# Altium schematic sheet 2_USB_UART.SchDoc
size A4; SheetNumber: 3; SheetTotal: 4
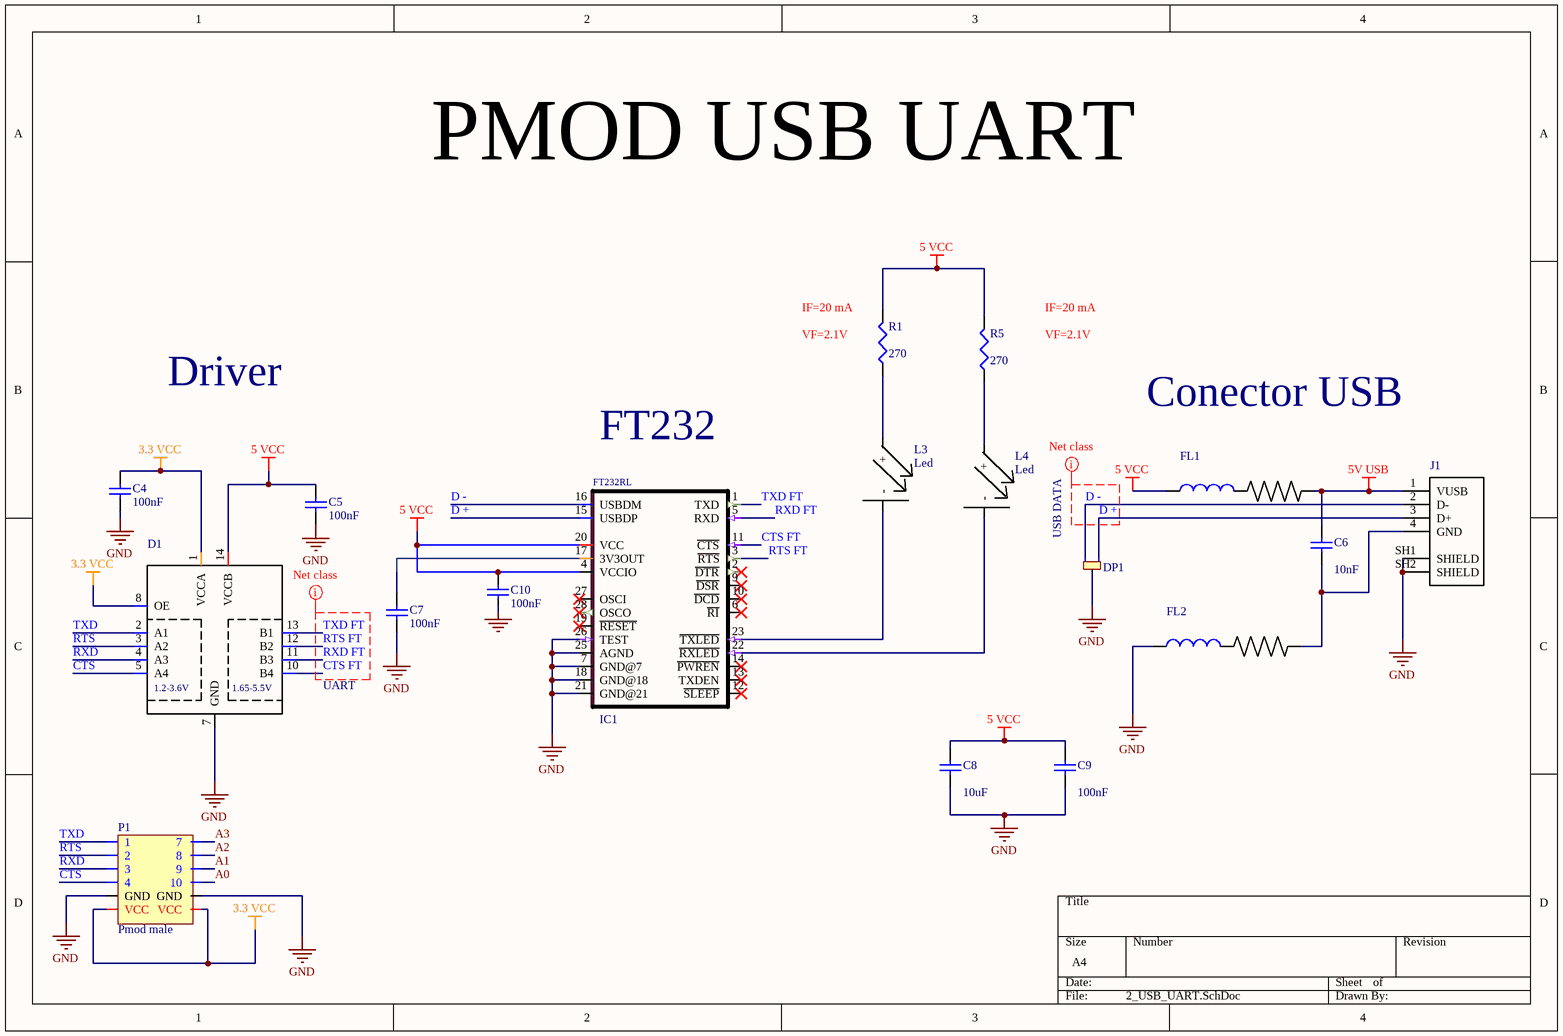
[diagram p0: 2_USB_UART.SchDoc]

## Parts
C4  value 100nF  [1608[0603]]  (hidden comment: Cap Semi)
C5  value 100nF  [1608[0603]]  (hidden comment: Cap Semi)
C6  value 10nF  [1608[0603]]  (hidden comment: Cap Semi)
C7  value 100nF  [1608[0603]]  (hidden comment: Cap Semi)
C8  value 10uF  [1608[0603]]  (hidden comment: Cap Semi)
C9  value 100nF  [1608[0603]]  (hidden comment: Cap Semi)
C10  value 100nF  [1608[0603]]  (hidden comment: Cap Semi)
D1  TXB0104PWR  [*TSSOP14]  (value not drawn)
DP1  PESD5V0U2BT,215  [*SOT95P230X110-3N]  (value not drawn)
FL1  BLM21PG221SN1D  [*BEADC2012X105N]  (value not drawn)
FL2  BLM21PG221SN1D  [*BEADC2012X105N]  (value not drawn)
IC1  FT232RL  [*SSOP28-LD]  (value not drawn)
J1  1-1734346-1  [*TE_1-1734346-1_1-1734346-1(Primary)]  (value not drawn)
L3  Led  [Diode1206 - PIN LETTER]
L4  Led  [Diode1206 - PIN LETTER]
P1  Pmod male  [901220766]
R1  value 270  [J1-0603]  (hidden comment: 270R)
R5  value 270  [J1-0603]  (hidden comment: 270R)

## Nets
3.3 VCC: C4.1 D1.1(VCCA) D1.8(OE) P1.6(VCC) P1.12(VCC)
5 VCC: C5.1 C8.2 C9.2 C10.1 D1.14(VCCB) FL1.1 IC1.4(VCCIO) IC1.20(VCC) R1.2 R5.2
5V USB: C6.2 FL1.2 J1.1(VUSB)
GND: C4.2 C5.2 C7.2 C8.1 C9.1 C10.2 D1.7(GND) DP1.3 FL2.1 IC1.7(GND@7) IC1.18(GND@18) IC1.21(GND@21) IC1.25(AGND) IC1.26(TEST) J1.SH1(SHIELD) J1.SH2(SHIELD) P1.5(GND) P1.11(GND)
A0: P1.10
A1: P1.9
A2: P1.8
A3: P1.7
CTS: D1.5(A4) P1.4
CTS FT: D1.10(B4) IC1.11(~{CTS})
D +: DP1.1 IC1.15(USBDP) J1.3(D+)
D -: DP1.2 IC1.16(USBDM) J1.2(D-)
RTS: D1.3(A2) P1.2
RTS FT: D1.12(B2) IC1.3(~{RTS})
RXD: D1.4(A3) P1.3
RXD FT: D1.11(B3) IC1.5(RXD)
TXD: D1.2(A1) P1.1
TXD FT: D1.13(B1) IC1.1(TXD)
NetC6_1: C6.1 FL2.2 J1.4(GND)
NetC7_1: C7.1 IC1.17(3V3OUT)
NetIC1_22: IC1.22(~{RXLED}) L4.K(-)
NetIC1_23: IC1.23(~{TXLED}) L3.K(-)
NetL3_A: L3.A(+) R1.1
NetL4_A: L4.A(+) R5.1

Not connected (* = marked no-connect by the designer): IC1 2(~{DTR})* 6(~{RI})* 9(~{DSR})* 10(~{DCD})* 12(~{SLEEP})* 13(TXDEN)* 14(~{PWREN})* 19(~{RESET})* 27(OSCI)* 28(OSCO)*

## Layout directives
net class USB DATA: D +, D -
net class UART: CTS FT, RTS FT, RXD FT, TXD FT

## Notes on the sheet
- PMOD USB UART
- (near R1) IF=20 mA
- IF=20 mA
- (near R1) VF=2.1V
- VF=2.1V
- Driver
- FT232
- Conector USB
- (in symbol TXB0104PWR) 1.2-3.6V; 1.65-5.5V

## Library data of the parts
C4-C10 = Cap Semi: Capacitor (Semiconductor SIM Model); Published: 8-Jun-2000; LatestRevisionDate: 29-May-2009; LatestRevisionNote: IPC-7351 Footprint Added.; PackageReference: C1206; Publisher: Altium Limited; PackageDescription: Chip Capacitor
D1 = TXB0104PWR: 4-Bit Bidirectional Voltage-Level Shifter with Auto Direction Sensing and +/-15 kV ESD Protect 14-TSSOP -40 to 85; MF: Texas Instruments; SnapEDA_Link: https://www.snapeda.com/parts/TXB0104PWR/Texas%20Instruments/view-part/?ref=snap; MP: TXB0104PWR; Availability: Unavailable; Price: None; Package: TSSOP-14 Texas Instruments; Value: *; Digi-KeyReference: 296-21929-1-ND
DP1 = PESD5V0U2BT,215: TVS DIODE 5V SOT23; Manufacturer 1: Nexperia; Supplier 1: Digi-Key; Manufacturer Part Number 1: PESD5V0U2BT,215; Stock 1: 61061; Pricing 1: 1=0,44000, 10=0,35300, 100=0,24020, 500=0,18012, 1000=0,13510 (USD); RoHS: No; ComponentLink1URL: https://assets.nexperia.com/documents/data-sheet/PESD5V0U2BT.pdf?src-supplier=Digi-Key; ComponentLink1Description: https://assets.nexperia.com/documents/data-sheet/PESD5V0U2BT.pdf?src-supplier=Digi-Key; Supplier Part Number 1: 1727-3936-1-ND; Digi-KeyReference: 1727-3936-1-ND
FL1 FL2 = BLM21PG221SN1D: 220 Ohms @ 100MHz 1 Power Line Ferrite Bead 0805 (2012 Metric) 2A 45mOhm; MF: Murata; Package: 2012 Murata; Digi-Key_Part_Number: 490-1054-1-ND; SnapEDA_Link: https://www.snapeda.com/parts/BLM21PG221SN1D/Murata/view-part/12270/?ref=snap; MP: BLM21PG221SN1D; Value: *
IC1 = FT232RL: USB-to-UART 1-CH 256Byte FIFO 5V 28-Pin SSOP; MF: FTDI, Future; Availability: Unavailable; Package: SSOP-28 FTDI, Future; SnapEDA_Link: https://www.snapeda.com/parts/FT232RL/FTDI%2C%20Future%20Technology%20Devices%20International%20Ltd/view-part/?ref=snap; Price: None; MP: FT232RL; Value: *; Digi-KeyReference: 768-1007-1-ND
J1 = 1-1734346-1: Conn USB 2.0 Type B RCP 4 POS 1.25mm Solder RA SMD 4 Terminal 1 Port T/R; MF: TE Connectivity; MP: 1-1734346-1; SnapEDA_Link: https://www.snapeda.com/parts/1-1734346-1/TE%20Connectivity%20AMP%20Connectors/view-part/512451/?ref=snap; EU_RoHS_Compliance: Compliant; Digi-Key_Part_Number: A110862CT-ND; DigiKey-Purchase-URL: https://snapeda.com/shop?store=DigiKey&id=512451; Package: None; Value: *
P1 = Pmod male: p mod male 6 position 2 rows
R1 R5 = Res3: Resistor; Published: 8-Jun-2000; LatestRevisionDate: 29-May-2009; LatestRevisionNote: IPC-7351 Footprint Added.; PackageReference: J1-0603; Publisher: Altium Limited; PackageDescription: Chip Resistor
L3 L4 = Led: Digi-KeyReference: 732-13395-1-ND